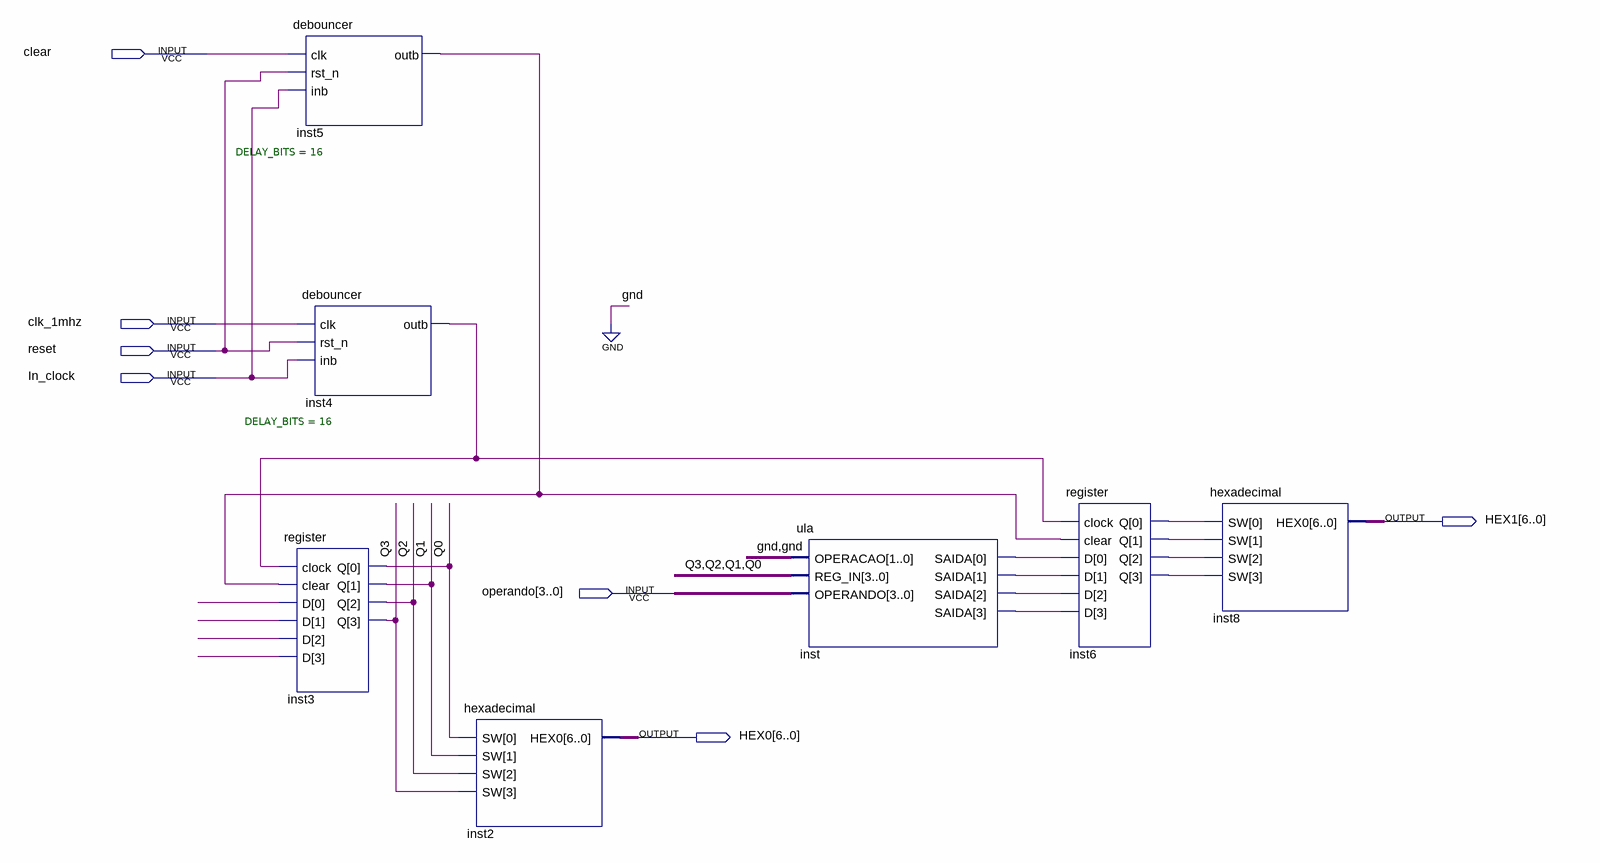
[diagram p0: schematic sheet]
// Quartus schematic teste_ula.bdf as structural Verilog: 7 symbols, 7 pins
module teste_ula (
  input  clear,
  input  clk_1mhz,
  input  reset,
  input  In_clock,
  input  [3:0] operando,
  output [6:0] HEX1,
  output [6:0] HEX0
);

  wire inst4_outb, inst5_outb, inst6_q, inst6_q_2, inst6_q_3, inst6_q_4, inst_saida, inst_saida_2,
       inst_saida_3, inst_saida_4, Q0, Q1, Q2, Q3, undriven, undriven_2, undriven_3, undriven_4;

  debouncer #(.DELAY_BITS(16)) inst5 (.clk(clear), .rst_n(reset), .inb(In_clock), .outb(inst5_outb));
  debouncer #(.DELAY_BITS(16)) inst4 (.clk(clk_1mhz), .rst_n(reset), .inb(In_clock), .outb(inst4_outb));
  register inst3 (
    .clock(inst4_outb), .clear(inst5_outb), .D({undriven_4, undriven_3, undriven_2, undriven}),
    .Q({Q3, Q2, Q1, Q0}));
  hexadecimal inst2 (.SW({Q3, Q2, Q1, Q0}), .HEX0(HEX0));
  ula inst (
    .OPERACAO(2'b00), .REG_IN({Q3, Q2, Q1, Q0}), .OPERANDO(operando),
    .SAIDA({inst_saida_4, inst_saida_3, inst_saida_2, inst_saida}));
  register inst6 (
    .clock(inst4_outb), .clear(inst5_outb), .D({inst_saida_4, inst_saida_3, inst_saida_2, inst_saida}),
    .Q({inst6_q_4, inst6_q_3, inst6_q_2, inst6_q}));
  hexadecimal inst8 (.SW({inst6_q_4, inst6_q_3, inst6_q_2, inst6_q}), .HEX0(HEX1));
endmodule
